# EAGLE design agri-module_rev1 (EAGLE 7.5.0)
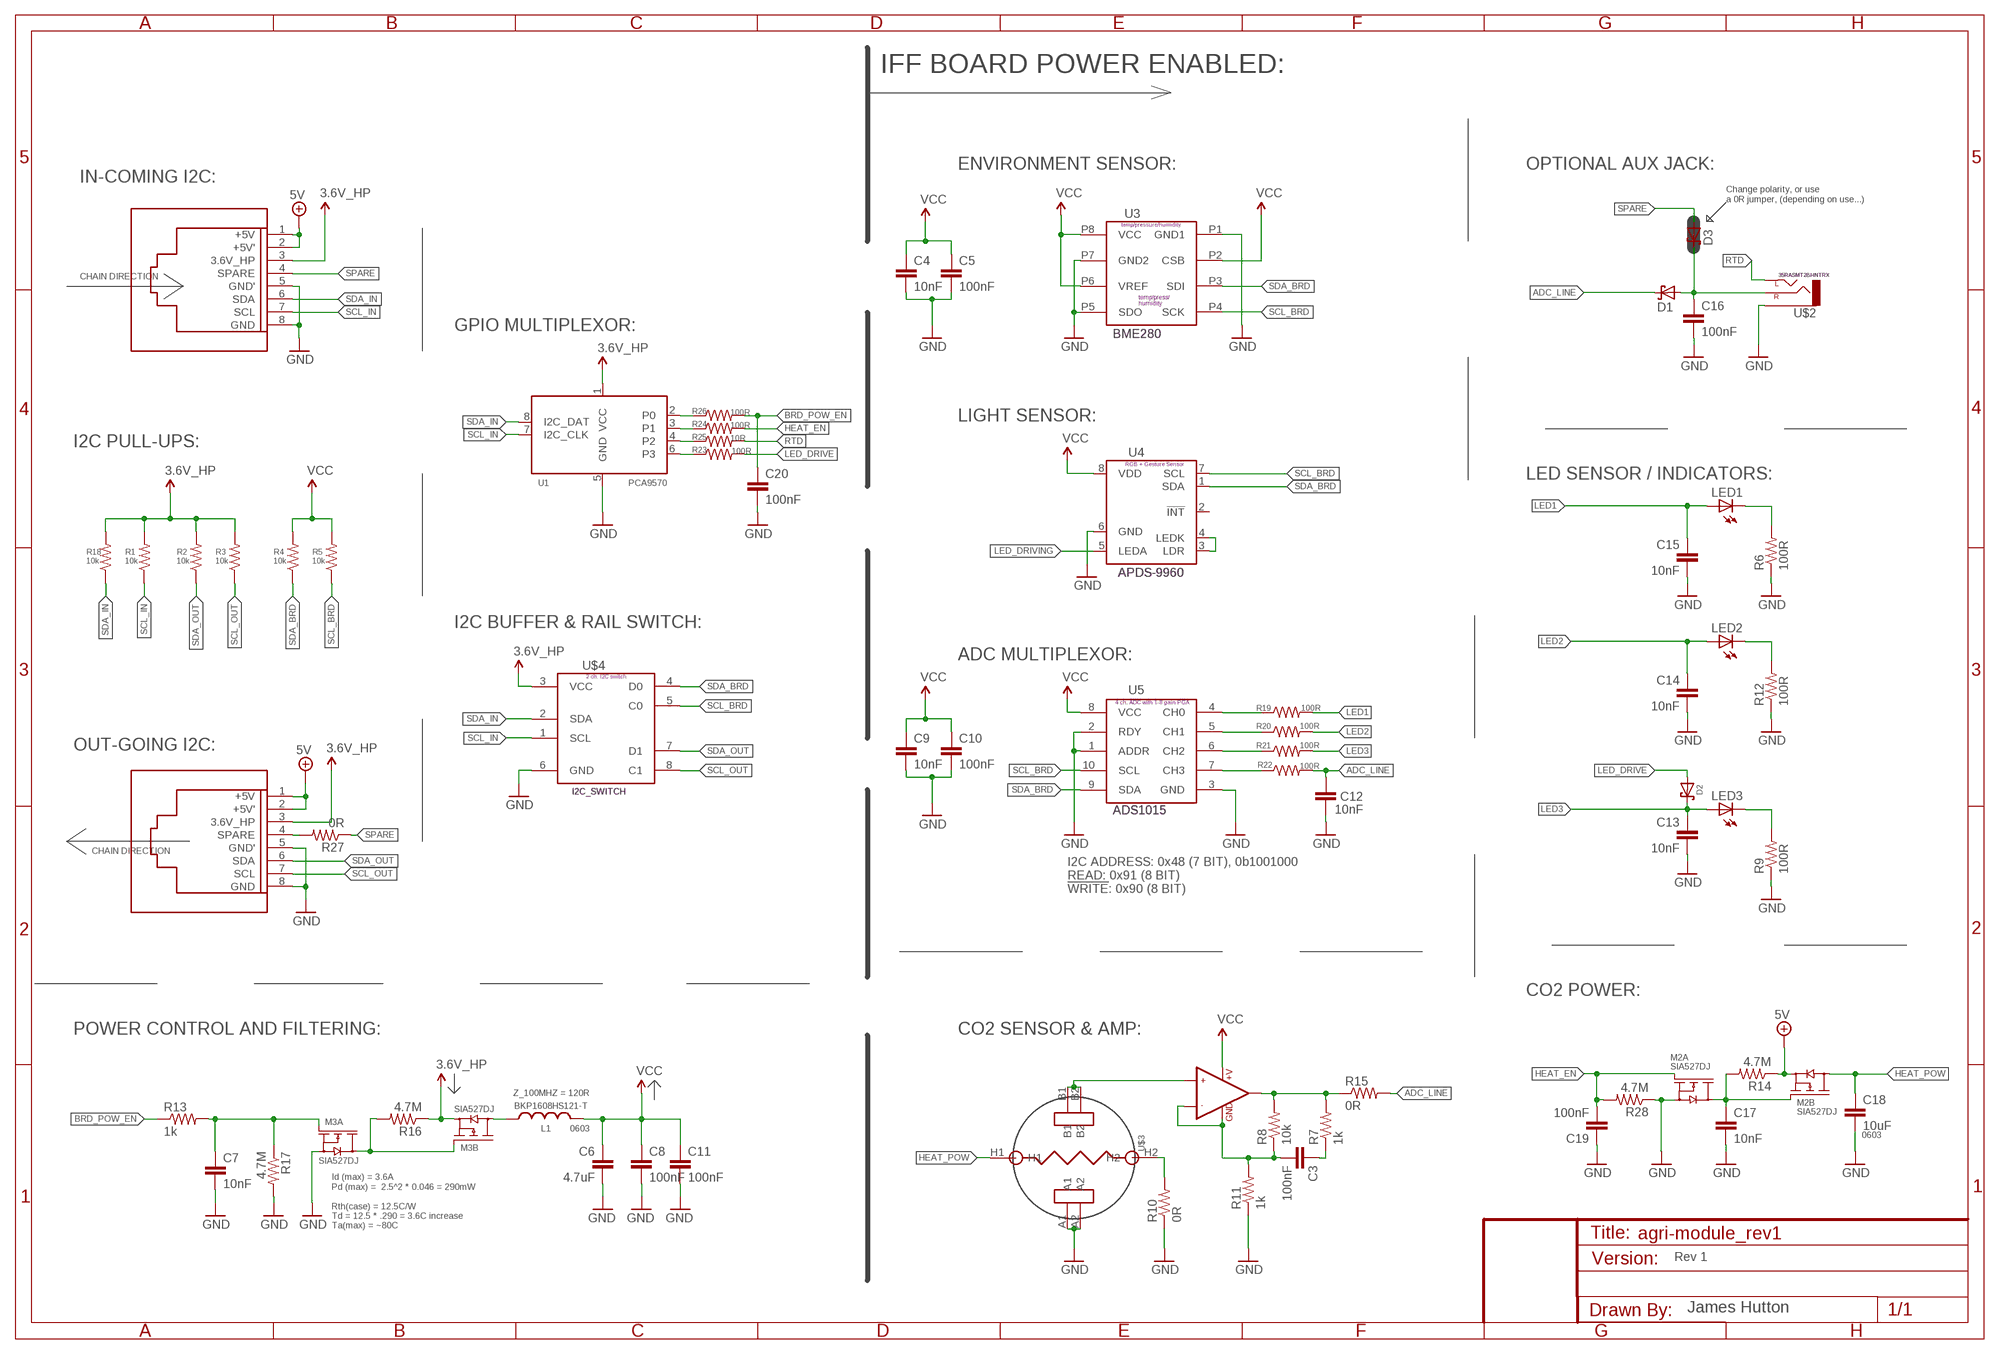
[diagram p0: schematic, sheet 1]

## Parts
C3  100nF  C_100N_0402  [C0402-BG]
C4  10nF  C_10N_0402  [C0402-BG]
C5  100nF  C_100N_0402  [C0402-BG]
C6  4.7uF  C_4.7U_0402  [C0402-BG]
C7  10nF  C_10N_0402  [C0402-BG]
C8  100nF  C_100N_0402  [C0402-BG]
C9  10nF  C_10N_0402  [C0402-BG]
C10  100nF  C_100N_0402  [C0402-BG]
C11  100nF  C_100N_0402  [C0402-BG]
C12  10nF  C_10N_0402  [C0402-BG]
C13  10nF  C_10N_0402  [C0402-BG]
C14  10nF  C_10N_0402  [C0402-BG]
C15  10nF  C_10N_0402  [C0402-BG]
C16  100nF  C_100N_0402  [C0402-BG]
C17  10nF  C_10N_0402  [C0402-BG]
C18  10uF  C_10U_0603  [C0603-BG]
C19  100nF  C_100N_0402  [C0402-BG]
C20  100nF  C_100N_0402  [C0402-BG]
D1  BAT54XV2  [SOD523]
D2  BAT54XV2  [SOD523]
D3  BAT54XV2  [SOD523]
L1  L-0603  [0603]
LED1  LEDCHIPLED-0603-TTW  [CHIPLED-0603-TTW]
LED2  LEDCHIPLED-0603-TTW  [CHIPLED-0603-TTW]
LED3  LEDCHIPLED-0603-TTW  [CHIPLED-0603-TTW]
M2  SIA527DJ  [SC-70-6-L]
M3  SIA527DJ  [SC-70-6-L]
R1  10k  R_10K_0402  [R0402-BG]
R2  10k  R_10K_0402  [R0402-BG]
R3  10k  R_10K_0402  [R0402-BG]
R4  10k  R_10K_0402  [R0402-BG]
R5  10k  R_10K_0402  [R0402-BG]
R6  100R  R_100R_0402  [R0402-BG]
R7  1k  R_1K_0402  [R0402-BG]
R8  10k  R_10K_0402  [R0402-BG]
R9  100R  R_100R_0402  [R0402-BG]
R10  0R  R_0R_0402  [R0402-BG]
R11  1k  R_1K_0402  [R0402-BG]
R12  100R  R_100R_0402  [R0402-BG]
R13  1k  R_1K_0402  [R0402-BG]
R14  4.7M  R_4.7M_0402  [R0402-BG]
R15  0R  R_0R_0402  [R0402-BG]
R16  4.7M  R_4.7M_0402  [R0402-BG]
R17  4.7M  R_4.7M_0402  [R0402-BG]
R18  10k  R_10K_0402  [R0402-BG]
R19  100R  R_100R_0402  [R0402-BG]
R20  100R  R_100R_0402  [R0402-BG]
R21  100R  R_100R_0402  [R0402-BG]
R22  100R  R_100R_0402  [R0402-BG]
R23  100R  R_100R_0402  [R0402-BG]
R24  100R  R_100R_0402  [R0402-BG]
R25  10R  R_10R_0402  [R0402-BG]
R26  100R  R_100R_0402  [R0402-BG]
R27  0R  R_0R_0402  [R0402-BG]
R28  4.7M  R_4.7M_0402  [R0402-BG]
U1  PCA9570  [XQFN8]
U3  BME280  [BME280]
U4  APDS-9960  [APDS-9960]
U5  ADS1015  [ADS1015]
U$1  RJ45_RA_SMD  [RJ45_RA_SMD]
U$2  35RASMT2BHNTRX  [35RASMTBHNTRX]
U$3  MG811  [MG811]
U$4  I2C_SWITCH  [SOT505-1]
U$5  MCP6001T  [SOT23-5]
U$9  RJ45_RA_SMD  [RJ45_RA_SMD]

## Nets
3.6V_HP: M3.4(B:S2) R1.2 R2.2 R3.2 R16.1 R18.2 U1.1(VCC) U$1.3(3.6V_HP) U$9.3(3.6V_HP)
3.6V_HP_FILT: U$4.3(VCC) ; supply symbol labelled 3.6V_HP
5V: M2.4(B:S2) R14.1 U$1.1(+5V) U$1.2(+5V') U$9.1(+5V) U$9.2(+5V')
ADC_LINE: C12.1 D1.C R15.2 R22.2
BRD_POW_EN: C20.1 R13.1 R26.2
GND: C4.2 C5.2 C6.2 C7.2 C8.2 C9.2 C10.2 C11.2 C12.2 C13.2 C14.2 C15.2 C16.2 C17.2 C18.2 C19.1 C20.2 M2.1(A:S1) M3.1(A:S1) R6.1 R9.1 R10.1 R11.1 R12.1 R17.2 R28.1 U1.5(GND) U3.P1(GND1) U3.P5(SDO) U3.P7(GND2) U4.6(GND) U5.1(ADDR) U5.2(RDY) U5.3(GND) U$1.5(GND') U$1.8(GND) U$2.5(SLEEVE) U$3.A1 U$3.A2 U$4.6(GND) U$9.5(GND') U$9.8(GND)
HEAT_EN: C19.2 M2.2(A:G1) R24.2 R28.2
HEAT_POW: C18.1 M2.3(B:D2) M2.TAB2(B:D2) U$3.H1
HOST_POW_EN: C7.1 M3.2(A:G1) R13.2 R17.1
LED1: C15.1 LED1.A@1(A) R19.2
LED2: C14.1 LED2.A@1(A) R20.2
LED3: C13.1 D2.C LED3.A@1(A) R21.2
LED_DRIVE: D2.A R23.2
LED_DRIVING: U4.5(LEDA)
M$65: R21.1 U5.6(CH2)
N$1: R26.1 U1.2(P0)
N$2: U4.3(LDR) U4.4(LEDK)
N$3: C16.1 D1.A D3.C U$2.1(RIGHT)
N$4: LED1.C@1(C) R6.2
N$5: C3.2 R8.1 R11.2 U$5.2(GND) U$5.4(-IN1)
N$6: R24.1 U1.3(P1)
N$7: U$3.B1 U$3.B2 U$5.3(+IN1)
N$8: R7.2 R8.2 R15.1 U$5.1(OUT1)
N$10: LED2.C@1(C) R12.2
N$11: LED3.C@1(C) R9.2
N$12: L1.1 M3.3(B:D2) M3.TAB2(B:D2)
N$13: R25.1 U1.4(P2)
N$14: C17.1 M2.5(B:G2) M2.6(A:D1) M2.TAB1(A:D1) R14.2
N$15: R23.1 U1.6(P3)
N$16: R27.2 U$9.4(SPARE)
N$17: R10.2 U$3.H2
N$19: C3.1 R7.1
N$26: M3.5(B:G2) M3.6(A:D1) M3.TAB1(A:D1) R16.2
N$66: R19.1 U5.4(CH0)
N$67: R20.1 U5.5(CH1)
N$69: R22.1 U5.7(CH3)
RTD: R25.2 U$2.4(LEFT)
SCL_BRD: R5.1 U3.P4(SCK) U4.7(SCL) U5.10(SCL) U$4.5(C0)
SCL_IN: R1.1 U1.7(I2C_CLK) U$1.7(SCL) U$4.1(SCL)
SCL_OUT: R3.1 U$4.8(C1) U$9.7(SCL)
SDA_BRD: R4.1 U3.P3(SDI) U4.1(SDA) U5.9(SDA) U$4.4(D0)
SDA_IN: R18.1 U1.8(I2C_DAT) U$1.6(SDA) U$4.2(SDA)
SDA_OUT: R2.1 U$4.7(D1) U$9.6(SDA)
SPARE: D3.A R27.1 U$1.4(SPARE)
VCC: C4.1 C5.1 C6.1 C8.1 C9.1 C10.1 C11.1 L1.2 R4.2 R5.2 U3.P2(CSB) U3.P6(VREF) U3.P8(VCC) U4.8(VDD) U5.8(VCC) U$5.5(+V)
Unconnected: U4.2(!INT)

## Notes on the sheet
- IFF BOARD POWER ENABLED:
- ENVIRONMENT SENSOR: | OPTIONAL AUX JACK:
- IN-COMING I2C:
- Change polarity, or use 
  a 0R jumper, (depending on use...)
- CHAIN DIRECTION
- temp/press/
  humidity
- GPIO MULTIPLEXOR:
- LIGHT SENSOR:
- I2C PULL-UPS:
- LED SENSOR / INDICATORS:
- I2C BUFFER & RAIL SWITCH:
- ADC MULTIPLEXOR:
- OUT-GOING I2C:
- CHAIN DIRECTION
- I2C ADDRESS: 0x48 (7 BIT), 0b1001000
  READ: 0x91 (8 BIT)
  !WRITE!: 0x90 (8 BIT)
- CO2 POWER:
- POWER CONTROL AND FILTERING: | CO2 SENSOR & AMP:
- Id (max) = 3.6A
  Pd (max) =  2.5^2 * 0.046 = 290mW
  
  Rth(case) = 12.5C/W
  Td = 12.5 * .290 = 3.6C increase
  Ta(max) = ~80C
- Rev 1
- James Hutton

## Library data of the parts
C3 C5 C8 C10 C11 C16 C19 C20 = BrainGrid - Capacitors:C_100N: 100nF Capacitor; ALTMANF: Samsung; ALTMPN: CL05B104KO5NNNC; MANF: Murata; MPN: GRM155R71C104KA88D; PACKAGE: 0402; TEMPCO: X7R; TOLERANCE: ±10%; VENDOR: Digikey; VMAX: 16V; VPN: 490-3261-2-ND
C4 C7 C9 C12-C15 C17 = BrainGrid - Capacitors:C_10N: 10nF Capacitor; MANF: Murata; MPN: GRM155R71E103KA01D; PACKAGE: 0402; TEMPCO: X7R; TOLERANCE: ±10%; VENDOR: Digikey; VMAX: 25V; VPN: 490-1312-1-ND
C6 = BrainGrid - Capacitors:C_4.7U: 4.7uF Capacitor; ALTMANF: Samsung; ALTMPN: CL05A475MP5NRNC; HEIGHT: 1mm; MANF: TDK Corporation; MPN: C1005X5R1A475M050BC; PACKAGE: 0402; TEMPCO: X5R; TOLEREANCE: ±20%; VMAX: 10V
C18 = BrainGrid - Capacitors:C_10U: 10uF Capacitor; ALTMANF: Taiyo Yuden; ALTMPN: EMK107BBJ106MA-T; MANF: Murata; MPN: ZRB18AC81C106ME01L; PACKAGE: 0603; TEMPCO: X6S; TOLERANCE: ±20%; VENDOR: Digikey; VMAX: 16V; VPN: 490-10986-1-ND
D1-D3 = BrainGrid - Diodes:BAT54XV2: Schottky Diodes Source: Fairchild .. BAT54.pdf; HEIGHT: 0.7mm; IMAX: 200mA; MANF: Fairchild Semiconductor; MPN: BAT54XV2; PACAKGE: SOD523; VENDOR: Digikey; VMAX: 30V; VPN: BAT54XV2CT-ND
L1 = BrainGrid - Inductors:L; DCR: 35mOhm; HEIGHT: 0.8mm; ISAT: 2700mA; MANF: Taiyo Yuden; MPN: BKP1608HS121-T; PACKAGE: 0603; VENDOR: Digikey; VPN: 587-3963-1-ND; Z_100MHZ: 120R
LED1-LED3 = BrainGrid - Diodes:LED: LED OSRAM: - CHIPLED LG R971, LG N971, LY N971, LG Q971, LY Q971, LO R971, LY R971 LH N974, LH R974 LS Q976, LO Q976, LY Q976 LO Q996 - Hyper CHIPLED LW Q18S LB Q993, LB Q99A, LB R99A - SideLED LS A670, LO A670, LY A670, LG A670, LP A670 LB A673, LV A673, LT A673, LW A673 LH A674 LY A675 LS A676, LA A676, LO A676, LY A676, LW A676 LS A679, LY A679, LG A679 - Hyper Micro SIDELED® LS Y876, LA Y876, LO Y876, LY Y876 LT Y87S - SmartLED LW L88C, LW L88S LB L89C, LB L89S, LG L890 LS L89K, LO L89K, LY L89K LS L896, LA L896, LO L896, LY L896 - TOPLED LS T670, LO T670, LY T670, LG T670, LP T670 LSG T670, LSP T670, LSY T670, LOP T670, LYG T670 LG T671, LOG T671, LSG T671 LB T673, LV T673, LT T673, LW T673 LH T674 LS T676, LA T676, LO T676, LY T676, LB T676, LH T676, LSB T676, LW T676 LB T67C, LV T67C, LT T67C, LS T67K, LO T67K, LY T67K, LW E67C LS E67B, LA E67B, LO E67B, LY E67B, LB E67C, LV E67C, LT E67C LW T67C LS T679, LY T679, LG T679 LS T770, LO T770, LY T770, LG T770, LP T770 LB T773, LV T773, LT T773, LW T773 LH T774 LS E675, LA E675, LY E675, LS T675 LS T776, LA T776, LO T776, LY T776, LB T776 LHGB T686 LT T68C, LB T68C - Hyper Mini TOPLED® LB M676 - Mini TOPLED Santana® LG M470 LS M47K, LO M47K, LY M47K Source: http://www.osram.convergy.de LUXEON: - LUMILED® LXK2-PW12-R00, LXK2-PW12-S00, LXK2-PW14-U00, LXK2-PW14-V00 LXK2-PM12-R00, LXK2-PM12-S00, LXK2-PM14-U00 LXK2-PE12-Q00, LXK2-PE12-R00, LXK2-PE12-S00, LXK2-PE14-T00, LXK2-PE14-U00 LXK2-PB12-K00, LXK2-PB12-L00, LXK2-PB12-M00, LXK2-PB14-N00, LXK2-PB14-P00, LXK2-PB14-Q00 LXK2-PR12-L00, LXK2-PR12-M00, LXK2-PR14-Q00, LXK2-PR14-R00 LXK2-PD12-Q00, LXK2-PD12-R00, LXK2-PD12-S00 LXK2-PH12-R00, LXK2-PH12-S00 LXK2-PL12-P00, LXK2-PL12-Q00, LXK2-PL12-R00 Source: www.luxeon.com KINGBRIGHT: KA-3528ASYC Source: www.kingbright.com
M2 M3 = BrainGrid - Transistors:SIA527DJ: N- and P-Channel 12-V (D-S) MOSFET, http://www.vishay.com/docs/64162/sia527dj.pdf Created by Michael Kadonoff, July 4th, 2016; HEIGHT: 0.75 mm; MANF: Vishay; MPN: SiA527DJ-T1-GE3; PACKAGE: SC70-6L; VENDOR: Digikey; VPN: SIA527DJ-T1-GE3*
R1-R5 R8 R18 = BrainGrid - Resistors:R_10K: 10k Resistor; ALTMANF: TE; ALTMPN: 1622826-4; MANF: Yageo; MPN: RC0402JR-0710KL; PACKAGE: 0402; TEMPCO: ±100ppm/°C; TOLERANCE: ±5%; VENDOR: Digikey; VPN: 311-10KJRCT-ND
R6 R9 R12 R19-R24 R26 = BrainGrid - Resistors:R_100R: 100 ohm resistor; ALTMANF: Samsung; ALTMPN: RC1005J101CS; MANF: Yageo; MPN: RC0402JR-07100RL; PACKAGE: 0402; TEMPCO: ±100ppm/°C; TOLERANCE: ±5%; VENDOR: Digikey; VPN: 311-100JRCT-ND
R7 R11 R13 = BrainGrid - Resistors:R_1K: 1k Resistor; ALTMANF: Samsung; ALTMPN: RC1005J102CS; MANF: Yageo; MPN: RC0402JR-071KL; PACKAGE: 0402; TEMPCO: ±100ppm/°C; TOLERANCE: ±5%; VENDOR: Digikey; VPN: 311-1.0KJRCT-ND
R10 R15 R27 = BrainGrid - Resistors:R_0R: 0 Ohm jumper; ALTMANF: Samsung; ALTMPN: RC1005J000CS; MANF: Yageo; MPN: RC0402JR-070RL; PACKAGE: 0402; VENDOR: Digikey; VPN: 311-0.0JRCT-ND
R14 R16 R17 R28 = BrainGrid - Resistors:R_4.7M; ALTMANF: Samsung; ALTMPN: RC1005J475CS; MANF: Vishay Dale; MPN: CRCW04024M70JNED; PACKAGE: 0402; TEMPCO: ±100ppm/°C; TOLERANCE: ±1%; VENDOR: Digikey; VPN: 541-4.7MJCT-ND
R25 = BrainGrid - Resistors:R_10R: 10 Ohm resistor; ALTMANF: Samsung; ALTMPN: RC1005F100CS; MANF: Yageo; MPN: RC0402JR-0710RL; PACKAGE: 0402; TEMPCO: ±200ppm/°C; TOLERANCE: ±5%; VENDOR: Digikey; VPN: 311-10JRCT-ND
U1 = BrainGrid - MAC-PHY-Glue:PCA9570: PCA9570, 4 OUTPUT I2C PORT EXPANDER XQFN8, SOT902-2, 1.6x1.6mm http://www.nxp.com/documents/data_sheet/PCA9570.pdf Created by Jul. 7, 2016 by M. Kadonoff; IQ: 6.5uA; MANF: NXP; MPN: PCA9570GM; PACKAGE: 8-XFQFN; TMAX: 85; TMIN: -40; VENDOR: Digikey; VMAX: 3.6; VMIN: 1.1; VPN: 568-10952-1-ND
U3 = BrainGrid - Sensors:BME280
U4 = BrainGrid - Sensors:APDS-9960: APDS-9960 Digital Proximity, Ambient Light, RGB and Gesture Sensor Supply Voltage: 2.4-3.6V Interface: I2C, 400kHz Package: L 3.94 × W 2.36 × H 1.35 mm http://www.avagotech.com/docs/AV02-4191EN Created by Michael Kadonoff August 15th, 2016 UNPROVEN; HEIGHT: 1.35 mm; IQ: 250 uA; MANF: Avago; MPN: APDS-9960
U5 = BrainGrid - Analog:ADS1015: 4 CHANNEL ADC MULTIPLEXER WITH PROGRAMMABLE GAIN; CURRENT: 10mA MAX; DATA: I2C; MANUFACTURER: texas instruments; MPN: ADS1015IDGSR; PACKAGE: 10-VSSOP, 10-MSOP, 10-TFSOP; RESOLUTION: 12-BIT; TEMP: -60 TO +150C; VOLTAGE: 2-5.5V
U$1 U$9 = BrainGrid - Electromechanical:RJ45_RA_SMD
U$2 = BrainGrid - Electromechanical:35RASMT2BHNTRX
U$3 = BrainGrid - Sensors:MG811: CO2 sensor - heating element http://www.futurlec.com/CO2_Sensor.shtml Created by James Hutton August 15th, 2016 UNPROVEN
U$4 = BrainGrid - Transistors:I2C_SWITCH: Remote 4-bit general purpose outputs for 1 MHz I2C-bus Latched outputs with a sink/source capability of 4 mA at 3.3 V Digital interface: I²C (up to 1MHz) Supply voltage: VDD main supply voltage range: 1.71 V to 3.6 V 40 C to +85 C operation http://www.nxp.com/documents/data_sheet/PCA9570.pdf Created by James Hutton August 15th, 2016 UNPROVEN; HEIGHT: 0.5mm; IQ: 1uA; MANF: nxp; PACKAGE: 8-XFQFN; PN: PCA9570
U$5 = SparkFun-AnalogIC:MCP6001T

## Board
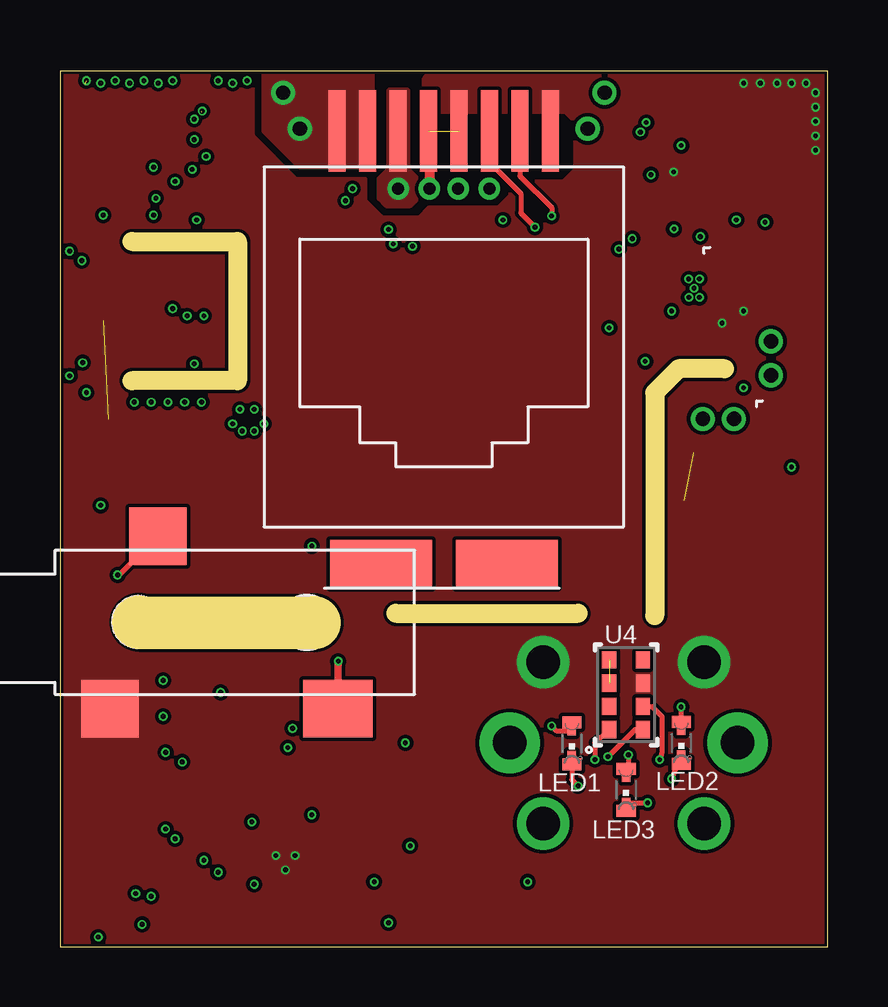
[diagram p1: board, top side]
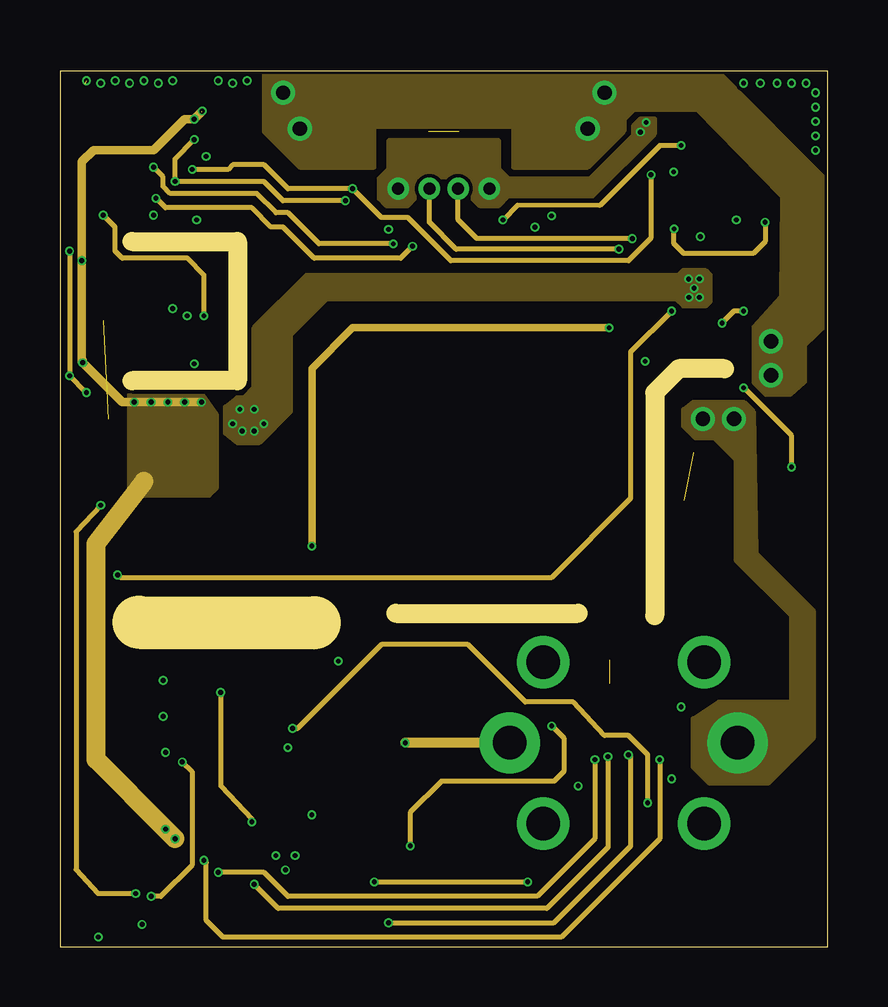
[diagram p2: board, inner layer Route2]
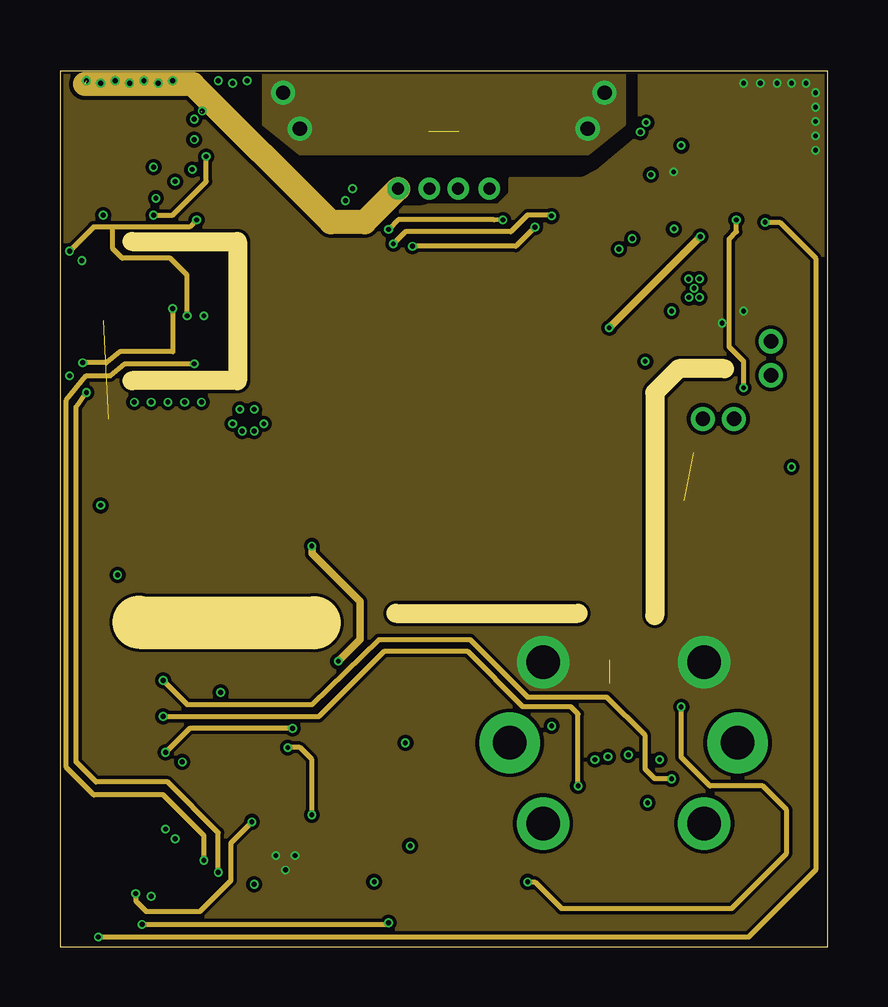
[diagram p3: board, inner layer Route15]
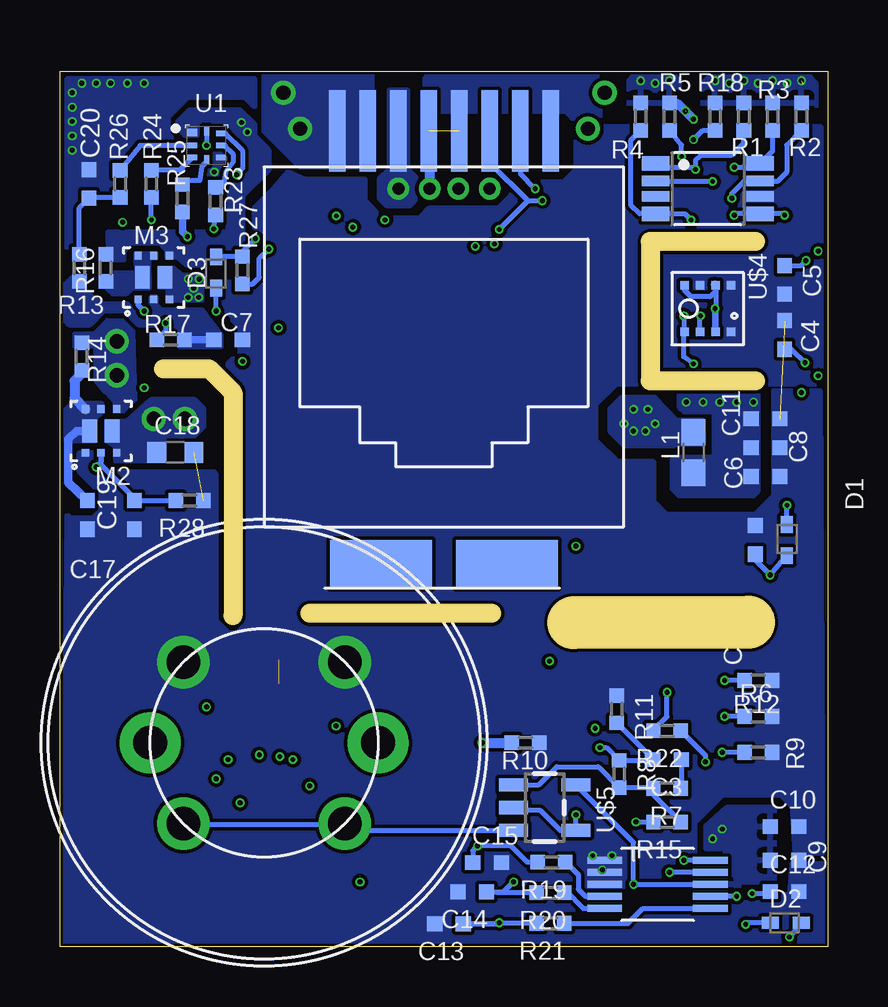
[diagram p4: board, bottom side, seen from below]

Size 32 x 36.5 mm. Coordinates in mm from the lower left corner, seen from the top.
Outline: 3,29.4 7.4,29.4 7.4,23.6 3,23.6
Outline: 14,13.9 21.6,13.9
Outline: 27.7,24.1 25.8,24.1 24.8,23.1 24.8,13.8
Outline: 3.3,13.52 10.6,13.5
Outline: 0,0 32,0 32,36.5 0,36.5 0,0
Copper layers (1+2*15+16): Top 0.035559375mm / dielectric 0.231140625mm / Route2 0.035559375mm / dielectric 37mil / Route15 0.035559375mm / dielectric 0.231140625mm / Bottom 0.035559375mm
Design rules "Braingrid Design Rules - 4 Layer": minimum track width 0.05mm, minimum drill 0.15mm, track to track 6mil, track to pad 6mil, pad to pad 6mil, via to via 6mil, smd to smd 0mil, copper to edge 5mil, drill to drill 5mil, minimum pad ring 5mil, minimum via ring 3mil, stop-mask expansion 3mil, vias tented up to drill 0.4mm, thermal gap 10mil

### Footprints (pad centres in the part's own frame; a part is rotated, then mirrored left to right if it is on the bottom)
C0402-BG = smd 0.635 x 0.61: 1 -0.597,0; 2 0.597,0
C0603-BG = smd 0.787 x 0.864: 1 -0.775,0; 2 0.775,0
SOD523 = smd 0.7 x 0.5: A 0.7,0; C -0.6,0
0603 = smd 1.1 x 1: 1 -0.85,0; 2 0.85,0
CHIPLED-0603-TTW = smd 0.8 x 0.5: A 0,-0.875; C 0,0.875 | smd 0.35 x 0.35: A@1 0,-0.5; C@1 0,0.5
SC-70-6-L = smd 0.3 x 0.325: 1 -0.65,-0.912; 2 0,-0.912; 3 0.65,-0.912; 4 0.65,0.912; 5 0,0.912; 6 -0.65,0.912 | smd 0.613 x 0.95: TAB1 -0.467,0; TAB2 0.467,0
R0402-BG = smd 0.6 x 0.61: 1 -0.57,0; 2 0.57,0
XQFN8 = smd 0.4 x 0.32: 1 -0.6,0.55 | smd 0.4 x 0.22: 2 -0.6,0; 3 -0.6,-0.5; 5 0.6,-0.5; 6 0.6,0; 7 0.6,0.5 | smd 0.22 x 0.4: 4 0,-0.6; 8 0,0.6
BME280 = smd 0.35 x 0.35: P1 0.975,0.975; P2 0.975,0.325; P3 0.975,-0.325; P4 0.975,-0.975; P5 -0.975,0.975; P6 -0.975,0.325; P7 -0.975,-0.325; P8 -0.975,-0.975
APDS-9960 = smd 0.6 x 0.72: 1 0.7,1.455; 2 0.7,0.485; 3 0.7,-0.485; 4 0.7,-1.455; 5 -0.7,-1.455; 6 -0.7,-0.485; 7 -0.7,0.485; 8 -0.7,1.455
ADS1015 = smd 0.3 x 1.45: 1 -1,-2.2; 2 -0.5,-2.2; 3 0,-2.2; 4 0.5,-2.2; 5 1,-2.2; 6 1,2.2; 7 0.5,2.2; 8 0,2.2; 9 -0.5,2.2; 10 -1,2.2
RJ45_RA_SMD = smd 0.7 x 3.4: 1 -4.445,9; 2 -3.175,9; 3 -1.905,9; 4 -0.635,9; 5 0.635,9; 6 1.905,9; 7 3.175,9; 8 4.445,9 | smd 4.25 x 2: NC1 -2.625,-9.05; NC2 2.625,-9.05
35RASMTBHNTRX = smd 2.4 x 2.4: 1 0.8,3.6; 5 -1.2,-3.6 | smd 2.9 x 2.4: 4 8.3,-3.6
MG811 = drill 1.4 pad 2.184: A1 -3.36,3.36; A2 3.36,3.36; B1 -3.36,-3.36; B2 3.36,-3.36 | drill 1.4 pad 2.54: H1 -4.75,0; H2 4.75,0
SOT505-1 = smd 0.6 x 1.15: 1 -1.05,-2.175; 4 1.05,-2.175; 5 1.05,2.175; 8 -1.05,2.175 | smd 0.45 x 1.15: 2 -0.325,-2.175; 3 0.325,-2.175; 6 0.325,2.175; 7 -0.325,2.175
SOT23-5 = smd 0.55 x 1.2: 1 -0.95,-1.3; 2 0,-1.3; 3 0.95,-1.3; 4 0.95,1.3; 5 -0.95,1.3

### Placement (x,y rotation side)
C3  6.7,7.8 180 bottom
C4  1.8,25.5 90 bottom
C5  1.8,27.8 270 bottom
C6  2.6,19.6 0 bottom
C7  25,25.3 0 bottom
C8  2.6,20.8 0 bottom
C9  1.8,3.6 0 bottom
C10  1.8,5 0 bottom
C11  2.6,22 0 bottom
C12  1.8,2.3 0 bottom
C13  15.79,0.95 180 bottom
C14  14.82,2.29 180 bottom
C15  14.2,3.5 0 bottom
C16  3.02,16.96 90 bottom
C17  30.86,18 270 bottom
C18  27.2,20.6 0 bottom
C19  28.9,18 90 bottom
C20  30.8,31.8 90 bottom
D1  1.7,17 270 bottom
D2  1.8,1 0 bottom
D3  25.51,28.06 90 bottom
L1  5.6,20.6 270 bottom
LED1  21.34,8.48 180 top
LED2  25.9,8.5 180 top
LED3  23.6,6.54 180 top
M2  30.3,21.5 0 bottom
M3  28.1,27.9 0 bottom
R1  3.5,34.6 90 bottom
R2  1.1,34.6 90 bottom
R3  2.3,34.6 90 bottom
R4  7.8,34.6 90 bottom
R5  6.6,34.6 90 bottom
R6  2.9,9.6 180 bottom
R7  6.7,6.6 180 bottom
R8  8.7,7.2 270 bottom
R9  2.9,8.1 180 bottom
R10  12.6,8.51 180 bottom
R11  8.8,9.9 270 bottom
R12  2.9,11.1 180 bottom
R13  31.2,28.3 270 bottom
R14  31.1,24.6 270 bottom
R15  6.7,5.2 180 bottom
R16  30.1,28.3 270 bottom
R17  27.4,25.3 180 bottom
R18  4.7,34.6 90 bottom
R19  11.52,3.52 180 bottom
R20  11.56,2.25 180 bottom
R21  11.57,0.97 180 bottom
R22  6.7,9 180 bottom
R23  25.52,31.08 270 bottom
R24  28.2,31.8 270 bottom
R25  26.9,31.2 270 bottom
R26  29.5,31.8 270 bottom
R27  24.4,28.2 270 bottom
R28  26.6,18.6 180 bottom
U1  25.9,33.4 0 bottom
U3  5,26.6 270 bottom
U4  23.6,10.5 180 top
U5  7.1,2.6 270 bottom
U$1  16,25 0 bottom
U$2  3.29,13.52 0 top
U$3  23.5,8.5 0 bottom
U$4  5,31.6 270 bottom
U$5  11.8,5.8 270 bottom
U$9  16,25 0 top

### Tracks (layer width: path | path; a pad name or v marks a point on that pad's centre or on a via)
3.6V_HP  (via drill 0.2, 0.5)  (1 unrouted)
  Route15 1: v14.1,31.6 12.7,30.2 11.3,30.2 5.53,35.97 1.03,35.97
  other vias: 17.9,31.6 24.2,33.96 24.44,34.36 4.7,36.1 4.1,36 3.5,36.1 2.9,36 2.3,36.1 1.7,36 1.1,36.1
  pour Top (no thermals): 13.7,35.7 13.7,32.4 13.3,32 13.3,31.2 13.6,30.9 14.6,30.9 14.9,31.2 14.9,32 14.5,32.4 14.5,35.7
  pour Route2 (no thermals): 13.7,33.6 13.7,32.4 13.3,32 13.3,31.2 13.6,30.9 14.5,30.9 14.8,31.2 14.8,32.1 17.2,32.1 17.2,31.2 17.5,30.9 18.3,30.9 18.7,31.3 22.2,31.3 24.8,33.9 24.8,34.5 24.2,34.5 23.9,34.2 23.9,33.8 22.1,32 18.7,32 18.3,32.4 18.3,33.6
  pour Bottom (no thermals): 26.3,33.8 26.8,33.8 27.1,34.1 27.1,34.4 26.6,34.9 24.5,34.9 23.9,34.3 23.92,33.74 24.1,33.62 24.28,33.62 24.72,34.02 24.72,34.14 24.98,34.4 26.3,34.4
  pour Bottom (no thermals): 27.54,28.72 27.54,29.08 27.6,29.08 27.82,29.3 29.08,29.3 29.36,28.98 29.36,28.62 29.8,28.62 29.82,28.64 29.98,28.84 30,29.8 25,29.8 24.93,31.26 24.91,33.04 24.89,33.71 25.1,34.4 24.1,34.4 23.9,34.2 23.9,33.8 23.3,33.2 23.3,32.4 24.4,31.3 24.4,28.6 24.7,28.4 26.72,28.4 27.1,28.72
  pour Bottom: 5.2,35 5.2,36 4.9,36.3 0.8,36.3 0.5,36 0.5,35
  pour Bottom (no thermals): 18.3,35.7 18.3,32.4 18.7,32 18.7,31.2 18.4,30.9 17.4,30.9 17.1,31.2 17.1,32 17.5,32.4 17.5,35.7
5V  (via drill 0.6)
  other vias: 29.64,23.82 29.64,25.24 22.7,35.6 22,34.1 9.3,35.6 10,34.1
  pour Route2: 8.5,36.5 8.5,34 10,32.5 13.1,32.5 13.1,34.2 18.9,34.2 18.9,32.5 22,32.5 23.5,34 23.5,36.5
  pour Bottom (no thermals): 19,36.5 19,32.5 22,32.5 23.5,34 23.5,36.5
  pour Top (no thermals): 13,36.5 13,32.5 10,32.5 8.5,34 8.5,36.5
  pour Route15: 8.5,36.5 8.5,34.3 10,33.1 22,33.1 23.5,34.3 23.5,36.5
  pour Route2: 20.96,36.47 27.42,36.47 32.01,31.88 32.01,25.99 31.04,25.06 31.04,23.54 30.44,23.02 29.46,23 28.94,23.52 28.94,25.84 30.1,27.1 30.14,31.26 26.6,34.9 23.9,34.9 23.5,34.5 23.5,34 22.66,33.2 21.5,33.2 21,33.7
  pour Bottom (no thermals): 29.78,22.28 29.78,22.68 30.1,23.06 30.18,23.12 30.56,23.58 30.56,25 31.44,25 31.44,25.58 30.58,25.62 30.06,26.16 29.38,26.14 28.92,25.68 28.84,22.78 29.34,22.28
ADC_LINE  (via drill 0.2)
  Route2 0.203: v1.7,18.4 0.68,17.31 0.68,3.21 1.58,2.22 v3.16,2.22 | v6.7,10.6 6.7,6.7 8,5.3 v8,5.2
  Route15 0.203: v8,5.2 7.13,4.32 7.13,2.76 5.84,1.47 3.59,1.47 3.16,1.91 v3.16,2.22
  Bottom 0.203: D1.C v1.7,18.4 | v8,5.2 R15.2 | v3.16,2.22 2.48,2.22 arc-90 C12.1 | R22.2 7.3,9.03 6.7,9.6 v6.7,10.6
BRD_POW_EN
  Bottom 0.203: R26.2 30.77,31.23 C20.1 31.2,30.8 R13.1
GND  (via drill 0.2)  (3 unrouted)
  Route2 0.203: v28.5,26.5 28.1,26.5 v27.6,26
  Bottom 0.203: M3.1 28.75,26.75 v28.5,26.5 | v27.6,26 27.6,25.67 R17.2
  other vias: 9.4,3.2 9,3.8 9.8,3.8 25.58,32.3 31.5,33.2 31.5,33.8 31.5,34.4 31.5,35 31.5,35.6 31.1,36 30.5,36 29.9,36 29.2,36 28.5,36
  pour Top (no thermals): 0.1,36.4 8,36.4 8,33.8 9.8,32 12.7,32 12.7,31.1 13.4,30.4 15,30.4 15.4,30.8 18.3,30.8 18.8,31.3 18.8,31.9 21,31.9 21.5,32.4 21.5,34.4 21.1,34.8 15.9,34.8 15.2,35.5 15.2,36.2 15.3,36.3 31.8,36.4 31.8,0.1 0.1,0.1
  pour Route15 (no thermals): 0.1,36.5 8,36.5 7.9,33.9 9.8,32.1 12.7,32.1 12.7,31.2 13.4,30.8 15,30.8 15.4,30.9 18.3,30.9 18.8,31.4 18.8,32 21.8,32 22.4,32.3 24.2,33.8 24.2,36.4 31.8,36.5 31.8,0.2 0.1,0.2
  pour Bottom (no thermals): 23.9,30.8 23.1,31.6 22.5,32.3 21.8,32 19.3,32 19.3,31.1 18.6,30.4 17,30.4 16.6,30.8 13.7,30.8 13.2,31.3 13.2,31.9 11,31.9 10.5,32.4 10.5,34.4 10.9,34.8 16.1,34.8 16.8,35.5 16.8,36.2 16.7,36.3 9.5,36.4 9.5,34.2 0.3,34.2 0.3,23.44 8.82,23.44 9.68,22.58 9.68,21.14 8.78,20.24 7.28,20.24 7.28,18.56 6.76,18.04 3.02,18.04 2.24,18.82 2.24,23.14 2.28,23.18 0.32,23.18 0.2,3.9 1.36,3.86 1.46,5.6 1.46,5.8 1.66,6.04 1.94,6.32 4.4,6.32 5.5,5.22 5.56,5.22 5.56,3.84 5.34,3.62 5.12,3.52 4.98,3.38 4.88,2.52 4.6,2.04 4.3,1.96 4.02,1.88 3.58,1.98 3.5,2.06 3.02,2.06 2.7,2.18 1.58,2.18 1.48,3.48 0.2,3.48 0.2,0.1 31.9,0.1 31.7,18 31.6,17.9 30.6,17.9 30.4,18.1 30.4,19 31.2,19.8 31.2,20.6 30.3,20.6 30.3,20.1 30,19.8 25.6,19.8 25.5,19.7 25.5,13.6 25,13.1 24.6,13.1 24.2,13.5 24.2,23.3 25,24.1 25,24.3 24.5,24.8 24.5,25.8 24.8,26.1 24.8,26.2 25.5,26.9 25.5,27.5 25.3,27.7 24.8,27.7 24.5,28 24.3,28 23.7,28.6 23.7,29.8 23.9,30
  pour Bottom (no thermals): 31.7,29.1 31.7,36.2 23.9,36.2 23.9,35 24.3,35.4 26.7,35.4 27.5,34.6 27.5,33.9 26.8,33.2 25,33.2 24.7,32.9 24.8,32.7 25.2,32.3 25,31.6 24.9,29.5 30,29.4 30.5,29.4 30.5,29.6 31,29.1
GND1  (via drill 0.2)
  other vias: 24.4,24.4
HEAT_EN  (via drill 0.2)
  Route2 0.203: v30.5,20 30.5,21.3 v28.5,23.3
  Route15 0.203: v28.5,23.3 28.5,24.4 27.9,25 27.9,29.5 28.2,29.8 v28.2,30.3
  Bottom 0.203: v30.5,20 30.3,20.2 M2.2 30.3,20.08 28.9,18.68 C19.2 R28.2 | v28.2,30.3 R24.2
HEAT_POW  (via drill 0.6)
  other vias: 26.8,22 28.1,22
  pour Bottom (no thermals): 27.64,20.26 27.64,21.32 26.44,21.26 26,21.7 26,22.42 26.4,22.8 28.2,22.8 29.22,21.9 30.08,21.9 30.08,21.1 29.7,20.86 29.7,20.26
  pour Route2 (no thermals): 26.4,22.7 28.5,22.7 28.9,22.3 29,16.4 31.4,14 31.4,8.7 29.5,6.8 27.1,6.8 26.4,7.5 26.4,9.5 27.46,10.2 30.5,10.2 30.5,13.8 28.2,16.1 28.2,20.3 27.3,21.2 26.5,21.2 26,21.7 26,22.4
HOST_POW_EN
  Bottom 0.305: C7.1 R17.1
  pour Bottom (no thermals): 27,25 27,25.7 27.2,25.9 28.7,25.9 29.3,26.5 30.2,26.5 30.8,25.9 31.6,25.9 31.8,26.1 31.8,27.6 31.5,27.9 31,27.9 31,27.4 30.3,26.8 29.22,26.8 28.99,26.56 28.34,26.56 28.2,26.74 28.2,27.1 28,27.1 28,26.74 27.82,26.56 26.08,26.56 25.3,25.5 25.3,25
LED1  (via drill 0.2)
  Top 0.203: LED1.A@1 20.72,8.98 v20.5,9.2
  Route2 0.203: v20.5,9.2 21,8.7 21,7.3 20.6,6.9 15.9,6.9 14.6,5.6 v14.6,4.2
  Bottom 0.203: R19.2 12.52,3.52 13.2,4.2 v14.6,4.2 14.75,4.05 14.8,4 14.8,3.7 C15.1
LED2  (via drill 0.2)
  Top 0.203: LED2.A@1 v25.9,10
  Route2 0.203: v13.1,2.7 v19.5,2.7
  Route15 0.203: v19.5,2.7 19.8,2.7 20.9,1.6 28,1.6 30.3,3.9 30.3,5.7 29.3,6.7 27.1,6.7 25.9,7.9 v25.9,10
  Bottom 0.203: R20.2 13.79,2.25 C14.1 13.51,2.29 v13.1,2.7
LED3  (via drill 0.2)
  Top 0.203: v23.7,8 23.7,7.14 LED3.A@1
  Route2 0.203: v13.7,1 20.6,1 23.8,4.2 23.8,7.9 v23.7,8
  Route15 0.203: v3.42,0.93 13.63,0.93 v13.7,1
  Bottom 0.203: R21.2 13.78,0.97 C13.1 13.74,0.95 v13.7,1 | D2.C 3.35,1 v3.42,0.93
LED_DRIVE  (via drill 0.2)
  Route2 0.203: v25.6,29.92 25.6,29.3 26,28.9 28.9,28.9 29.4,29.4 v29.4,30.2
  Route15 0.203: v29.4,30.2 30,30.2 31.5,28.7 31.5,3.2 28.7,0.4 v1.6,0.4
  Bottom 0.203: D2.A v1.6,0.4 | v25.6,29.92 R23.2
M$65
  Bottom 0.203: R21.1 8.32,0.97 7.7,1.6 U5.6
N$1
  Bottom 0.203: U1.2 28.67,33.4 R26.1
N$2  (1 unrouted)
N$3  (via drill 0.2)
  Top 0.203: 4.37,17.4 U$2.1 2.47,15.5 v2.4,15.5
  Route2 0.203: v2.4,15.5 2.5,15.4 20.5,15.4 23.8,18.7 23.8,24.8 v25.5,26.5
  Bottom 0.203: D1.A v2.4,15.5 3.02,16.12 C16.1 | v25.5,26.5 25.5,27.3 25.6,27.4 D3.C
N$4  (via drill 0.2)
  Top 0.203: 21.34,7.94 LED1.C@1 21.34,6.96 v21.6,6.7
  Route15 0.203: v4.3,9.6 10.8,9.6 13.5,12.3 17,12.3 19.3,10 21.3,10 21.6,9.7 v21.6,6.7
  Bottom 0.203: R6.2 v4.3,9.6
N$5  (via drill 0.2)
  Route15 0.203: v10.5,5.5 10.5,7.8 10,8.3 v9.5,8.3
  Bottom 0.203: U$5.2 13,5.7 12,5.7 11.15,4.85 U$5.4 | U$5.4 | U$5.4 v10.5,5.5 | v9.5,8.3 9.23,8.3 R8.1 7.33,7.77 C3.2 7.3,7.83 R11.2
N$6
  Bottom 0.203: U1.3 27.03,32.37 R24.1
N$7
  Bottom 0.203: U$3.B1 26.82,5.1 20.2,5.1 20.14,5.06 | 20.14,5.06 U$3.B2 | 20.14,5.06 20.03,4.85 U$5.3
N$8
  Bottom 0.203: R15.1 7.27,6.34 R7.2 7.3,6.63 R8.2 9.57,7.5 11.3,7.5 12.05,6.75 U$5.1
N$10  (via drill 0.2)
  Top 0.203: v25.5,7 LED2.C@1
  Route15 0.203: v4.3,11.1 5.3,10.1 10.5,10.1 13.3,12.8 17.1,12.8 19.5,10.4 22.8,10.4 24.4,8.8 24.4,7.4 24.8,7 v25.5,7
  Bottom 0.203: R12.2 v4.3,11.1
N$11  (via drill 0.2)
  Top 0.203: LED3.C@1 23.64,6 v24.5,6
  Route2 0.203: v24.5,6 24.5,8 23.7,8.8 22.7,8.8 21.4,10.2 19.4,10.2 17,12.6 13.4,12.6 9.9,9.1 v9.7,9.1
  Route15 0.203: v9.7,9.1 5.4,9.1 v4.4,8.1
  Bottom 0.203: R9.2 v4.4,8.1
N$12  (via drill 0.2)
  other vias: 26.66,27.07 26.22,27.07 26.44,27.45 26.66,27.84 26.21,27.84 7.5,22.4 7.2,21.8 7.6,21.5 8.1,21.5 8.5,21.8 8.1,22.4
  pour Bottom (no thermals): 26.1,28 26.11,26.92 27.5,26.93 27.5,27.47 27.85,27.47 27.86,28.32 27.3,28.3 26.9,28
  pour Route2 (no thermals): 26,28.2 26.9,28.2 27.1,28 27.1,26.9 26.9,26.7 26,26.7 25.7,27 11.1,27 9.6,25.5 9.6,22.3 8.3,21 7.4,21 6.9,21.4 6.9,22.5 7.4,22.9 7.7,22.9 8.1,23.3 8.1,25.8 10.3,28 25.8,28
  pour Bottom (no thermals): 5.17,20.96 5.18,21.93 6.28,21.93 7.2,22.9 8.6,22.9 9.1,22.4 9.1,21.5 8.5,20.9 6.4,20.9 6.3,20.95
N$13
  Bottom 0.203: 25.9,32.84 U1.4 25.9,32.72 26.1,32.52 26.18,31.94 26.48,31.94 27,31.88 27,31.7 R25.1
N$14
  Bottom 0.35: C17.1 30.88,18.6 31.66,19.36 31.66,21.16 31.32,21.5 M2.TAB1
  Bottom 0.406: R14.2 31.1,23.9 31.4,23.6 31.4,22.86 M2.6
  pour Bottom (no thermals): 30.24,22.3 30.24,22.64 31.5,22.64 31.76,22.38 31.76,21.1 30.56,21.1 30.56,22.02
N$15
  Bottom 0.203: U1.6 25.12,33.41 25.14,33.4 24.8,33.06 24.8,32.7 25.1,32.3 25.2,31.67 25.43,31.67 R23.1
N$16  (via drill 0.2, 0.5)
  Top 0.406: U$9.4 15.4,33.97 v15.4,31.6
  Route2 0.203: v23.3,29.08 16.52,29.08 15.4,30.2 v15.4,31.6
  Bottom 0.203: R27.2 23.97,27.63 23.7,27.9 23.7,28.7 v23.3,29.08
N$17  (via drill 0.2)
  Route2 0.406: U$3.H2 v14.4,8.5
  Bottom 0.406: v14.4,8.5 13.18,8.5 R10.2
N$19
  Bottom 0.203: C3.1 6.1,6.63 R7.1
N$26
  pour Bottom (no thermals): 28.02,28.9 28.02,28.7 28.32,28.7 28.3,27.44 29.04,27.44 29.28,27.2 29.8,27.2 30,27.4 30,28 29.9,28.1 28.82,28.1 28.84,28.9
N$66
  Bottom 0.203: R19.1 10.9,3.5 10.4,3 10.4,2.4 10.1,2.1 U5.4
N$67
  Bottom 0.203: R20.1 10.9,2.3 10.2,1.6 U5.5
N$69  (via drill 0.2)
  Route2 0.203: v5.1,7.7 5.5,7.3 5.5,3.4 4.2,2.1 v3.8,2.1
  Bottom 0.203: R22.1 5.1,7.97 v5.1,7.7 | v3.8,2.1 U5.7
RTD  (via drill 0.2)
  Top 0.305: v11.6,11.9 U$2.4
  Route2 0.305: v22.9,25.8 12.2,25.8 10.5,24.1 v10.5,16.7
  Route15 0.305: v26.7,29.6 v22.9,25.8 | v10.5,16.7 10.5,16.4 12.5,14.4 12.5,12.8 v11.6,11.9
  Bottom 0.305: R25.2 26.9,29.8 v26.7,29.6
SCL_BRD  (via drill 0.2)
  Top 0.203: U4.7 24.68,10.02 25.1,9.6 25.1,8.1 v25,7.8
  Route2 0.203: v25,7.8 25,4.5 20.9,0.4 6.8,0.4 6.1,1.1 6.1,3.5 v6,3.6 | v6,26.3 6,28 5.33,28.7 2.6,28.7 2.3,29 2.3,30 v1.8,30.5
  Route15 0.203: v3.9,30.5 4.7,30.5 6.1,31.9 6.1,32.9 v6.09,32.94 | v6,3.6 6,4.63 4.3,6.33 1.42,6.33 0.26,7.48 0.26,22.78 1.1,23.8 2.1,23.8 2.7,24.3 v5.6,24.3
  Bottom 0.203: v3.9,30.5 3.85,30.55 U$4.5 1.75,30.55 v1.8,30.5 | v6.09,32.94 6.1,33.42 R5.1 | U5.10 v6,3.6 | v5.6,24.3 6,24.6 6,25.6 U3.P4 5.97,26.27 v6,26.3
SCL_IN  (via drill 0.2)
  Route2 0.203: v24.64,32.18 24.63,29.53 23.7,28.6 16.3,28.6 14.5,30.4 13.4,30.4 v12.2,31.6 9.5,31.6 8.5,32.6 7.2,32.6 7,32.4 v5.51,32.4
  Bottom 0.203: U1.7 25.1,33.9 24.4,33.2 24.39,32.47 v24.64,32.18 | v12.2,31.6 12.8,32.2 12.8,33.98 U$1.7 | U$4.1 7.03,32.6 6.8,32.48 5.6,32.48 v5.51,32.4 5.5,32.8 5.3,33 4,33 3.5,33.5 R1.1
SCL_OUT  (via drill 0.2)
  Top 0.203: U$9.7 19.18,32.12 20.5,30.8 v20.49,30.46
  Route2 0.203: v13.9,29.3 10.8,29.3 9.5,30.6 9,30.6 8.2,31.4 4.6,31.4 4.3,31.7 4.3,32.1 v3.9,32.5
  Route15 0.203: v20.49,30.46 20.44,30.51 19.49,30.5 18.8,29.8 14.4,29.8 v13.9,29.3
  Bottom 0.203: v3.9,32.5 2.98,32.5 U$4.8 2.3,33.17 R3.1
SDA_BRD  (via drill 0.2)
  Top 0.203: U4.1 22.3,8.5 v22.3,7.8
  Route2 0.203: v22.3,7.8 22.3,4.5 19.9,2.11 9.5,2.1 8.5,3.1 8.3,3.1 v6.6,3.1 | v1.1,23.1 v0.4,23.8 v0.4,29
  Route15 0.203: v5.7,30.3 5.4,30 2.2,30 | v6.6,3.1 6.6,4.75 4.49,6.87 1.5,6.86 0.67,7.7 0.67,22.5 v1.1,23.1 | 2.2,30 1.4,30 v0.4,29 | v5.3,26.3 5.3,28 4.6,28.7 2.6,28.7 2.2,29.1 2.2,30
  Bottom 0.203: R4.1 8.2,33.63 8.2,30.9 7.85,30.55 U$4.4 5.95,30.55 v5.7,30.3 | 5.3,25.6 U3.P3 5.33,26.27 v5.3,26.3 | U5.9 v6.6,3.1
SDA_IN  (via drill 0.2)
  Route2 0.203: v11.9,31.1 9.3,31.1 8.5,31.9 v4.8,31.9 4.79,32.84 v5.6,33.65 | v25.9,33.4 25,33.4 22.5,30.9 19.07,30.91 v18.46,30.3
  Route15 0.203: v18.46,30.3 18.1,30.3 14.1,30.3 v13.7,29.9
  Bottom 0.203: U$1.6 14.1,32.7 12.5,31.1 | 12.5,31.1 v11.9,31.1 | v4.8,31.9 7.15,31.9 U$4.2 | U1.8 v25.9,33.4 | v13.7,29.9 12.5,31.1 | v5.6,33.65 5.2,34.04 R18.1
SDA_OUT  (via drill 0.2)
  Top 0.203: U$9.6 17.91,32.7 19.21,31.4 19.21,30.59 v19.8,30
  Route2 0.203: v14.7,29.2 14.2,28.7 10.6,28.7 9.3,30 8.8,30 8,30.8 4.4,30.8 v4,31.2
  Route15 0.203: v19.8,30 19,29.2 v14.7,29.2
  Bottom 0.203: R2.1 1.72,33.41 1.72,32.28 2.1,31.9 2.8,31.9 U$4.7 2.85,31.9 3.5,31.9 4,31.4 v4,31.2
SPARE  (via drill 0.2, 0.5)
  Route2 0.203: v23.86,29.52 17.38,29.52 16.6,30.3 v16.6,31.6
  Bottom 0.203: v23.86,29.52 24.41,28.97 R27.1 25.57,28.77 D3.A
  Bottom 0.406: U$1.4 16.6,33.97 v16.6,31.6
VCC  (via drill 0.2)  (1 unrouted)
  Top 0.203: U4.8 23.96,9.04 v22.84,7.92
  Route2 0.203: v22.84,7.92 22.84,4.14 20.3,1.6 9.1,1.6 v8.1,2.6
  Route2 0.35: v5.9,22.7 v5.2,22.7 v4.5,22.7 v3.8,22.7 v3.1,22.7 2.6,22.7 v0.95,24.35 | 5.9,34.8 v5.6,34.5 5.2,34.5 3.9,33.2 1.4,33.2 0.91,32.72 0.91,29.91 0.91,29.08 v0.91,28.6 0.91,24.5 | v0.95,24.35 0.91,24.38 0.91,24.5 | v0.95,24.35 0.95,24.46 0.91,24.5
  Route2 0.8: 3.5,19.4 1.5,16.8 1.5,7.8 v4.4,4.9 v4.8,4.5
  Route15 0.203: v4.7,26.6 4.7,24.8 2.5,24.8 1.95,24.35 v0.95,24.35
  Bottom 0.203: 4.67,27.32 U3.P2 4.7,25.65 v4.7,26.6 | U3.P6 4.67,27.32 | 4.67,27.32 4.9,27.1 5.7,27.1 5.97,27.38 U3.P8 6,27.6 | U5.8 v8.1,2.6 8.1,4.35 U$5.5 | C5.1 1.11,28.4 v0.91,28.6 | C4.1 1.5,24.9 v0.95,24.35
  Bottom 0.35: R5.2 6.27,35.17 v5.6,34.5 | 4.7,27.6 U3.P6
  other vias: 6.6,36.1 7.2,36 7.8,36.1 5.93,34.83
  pour Bottom: 6.2,35 8.3,35 8.3,36.1 8.1,36.3 6.4,36.3 6.2,36.1
  pour Bottom (no thermals): 2.9,19 2.9,23 5.94,22.99 6.2,23 6.2,22.5 6,22.3 4.74,22.3 4.74,20.4 6.4,20.4 6.5,20.3 6.5,19.1 6.2,18.8 3.1,18.8
  pour Route2 (no thermals): 2.9,19 2.9,23 5.94,22.99 6.5,22.2 6.5,19.1 6.2,18.8 3.1,18.8
  pour Bottom: 2.2,2.7 2.2,5.8 4.2,5.8 5.1,5 5.1,4.1 4.3,4.1 4.3,2.5 3.7,2.5 3.7,2.6 3.6,2.7